# EAGLE design ControlBoard (EAGLE 7.4.0)
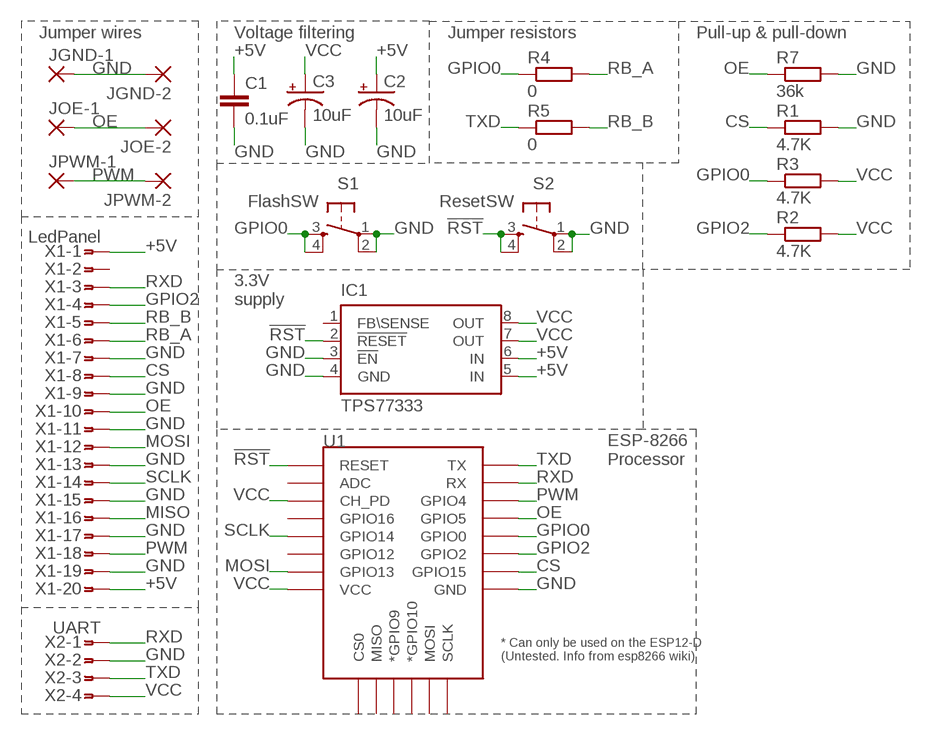
[diagram p0: schematic, sheet 1]

## Parts
C1  0.1uF  0.1UF-25V(+80/-20%)(0603)  [0603-CAP]
C2  10uF  10UF-20V-10%(TANT)  [EIA3528]
C3  10uF  10UF-20V-10%(TANT)  [EIA3528]
IC1  TPS77333  [SOP-08]
JGND-1  SMD2  [SMD1,27-2,54]
JGND-2  SMD2  [SMD1,27-2,54]
JOE-1  SMD2  [SMD1,27-2,54]
JOE-2  SMD2  [SMD1,27-2,54]
JPWM-1  SMD2  [SMD1,27-2,54]
JPWM-2  SMD2  [SMD1,27-2,54]
R1  4.7K  R-EU_R1206  [R1206]
R2  4.7K  R-EU_R1206  [R1206]
R3  4.7K  R-EU_R1206  [R1206]
R4  0  R-EU_R5025W  [R5025W]
R5  0  R-EU_R5025W  [R5025W]
R7  36k  R-EU_M2012  [M2012]
S1  FlashSW  DTSM-6  [DTSM-6]
S2  ResetSW  DTSM-6  [DTSM-6]
U1  ESP12ESMD  [ESP12E-SMD]
X1  LedPanel  SMDTOP-20  [SMDTOP20]
X2  UART  SMDTOP-4  [SMDTOP4]

## Nets
!RST [signal]: IC1.2(!RESET) S2.3 S2.4 U1.RESET
+5V [power]: C1.1 C2.A(+) IC1.5(IN) IC1.6(IN) X1.1 X1.20
CS [signal]: R1.1 U1.GPIO15 X1.8
GND [power]: C1.2 C2.C(-) C3.C(-) IC1.3(!EN) IC1.4(GND) JGND-1.1(P) JGND-2.1(P) R1.2 R7.2 S1.1 S1.2 S2.1 S2.2 U1.GND X1.7 X1.9 X1.11 X1.13 X1.15 X1.17 X1.19 X2.2
GPIO0 [signal]: R3.1 R4.1 S1.3 S1.4 U1.GPIO0
GPIO2 [signal]: R2.1 U1.GPIO2 X1.4
MISO [signal]: X1.16
MOSI [signal]: U1.GPIO13 X1.12
OE [signal]: JOE-1.1(P) JOE-2.1(P) R7.1 U1.GPIO5 X1.10
PWM [signal]: JPWM-1.1(P) JPWM-2.1(P) U1.GPIO4 X1.18
RB_A [signal]: R4.2 X1.6
RB_B [signal]: R5.2 X1.5
RXD [signal]: U1.RXD0(RX) X1.3 X2.1
SCLK [signal]: U1.GPIO14 X1.14
TXD [signal]: R5.1 U1.TXD0(TX) X2.3
VCC [power]: C3.A(+) IC1.7(OUT) IC1.8(OUT) R2.2 R3.2 U1.CH_PD U1.VCC X2.4
Unconnected: IC1.1(FB\SENSE) U1.ADC U1.CS0 U1.GPIO9(*GPIO9) U1.GPIO10(*GPIO10) U1.GPIO12 U1.GPIO16 U1.MISO U1.MOSI U1.SCLK X1.2

## Notes on the sheet
- Jumper wires | Voltage filtering | Jumper resistors | Pull-up & pull-down
- 3.3V
  supply
- ESP-8266
  Processor

## Library data of the parts
C1 = SparkFun-Capacitors:0.1UF-25V(+80/-20%)(0603): CAP-00810 Ceramic Standard decoupling cap; PROD_ID: CAP-00810
C2 C3 = SparkFun-Capacitors:10UF-20V-10%(TANT): CAP-08063; PROD_ID: CAP-08063
IC1 = texas:TPS773*: 250-mA LDO REGULATORS WITH RESET OUTPUT WITH 8-PIN MSOP PACKAGING Source: http://focus.ti.com/lit/ds/symlink/tps77333.pdf; MF: TEXAS INSTRUMENTS; MPN: TPS77333DGK; OC_FARNELL: 1510195; OC_NEWARK: 02M1919
JGND-1 JGND-2 JOE-1 JOE-2 JPWM-1 JPWM-2 = wirepad:SMD2: SMD PAD
R1-R5 R7 = resistor:R-EU_: RESISTOR, European symbol
S1 S2 = switch-tact:DTSM-6
U1 = esp8266modules:ESP12E: ESP12E Module
X1 = con-amp:SMDTOP-20: AMP connector
X2 = con-amp:SMDTOP-4: AMP connector

## Net classes
1 power: width 0.508 mm
2 signal: width 0.508 mm
3 VIN: width 0.61 mm, clearance 2 mm to class 1, clearance 2 mm to class 2

## Board
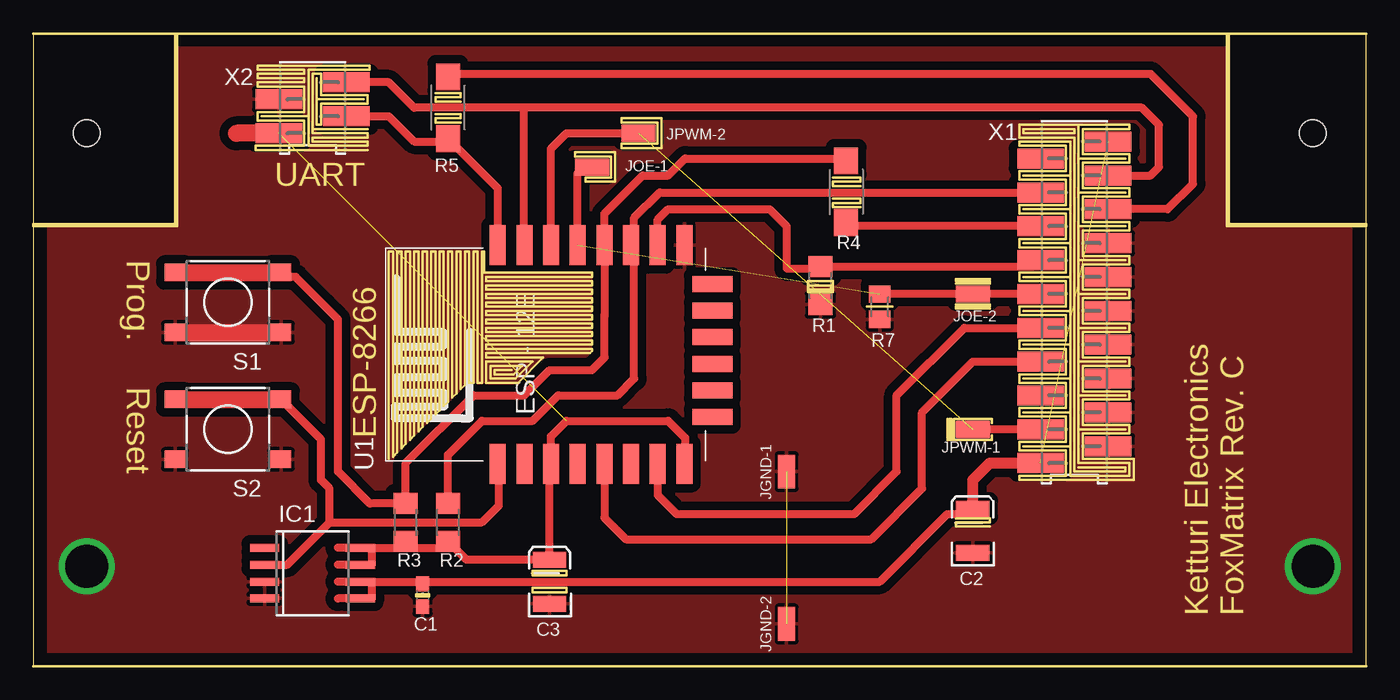
[diagram p1: board, top side]

Size 100 x 47.5 mm. Coordinates in mm from the lower left corner, seen from the top.
Outline: 0,0 100,0 100,47.5 0,47.5 0,0
Copper layers (1*16): Top 0.3mm / dielectric 1.2mm / Bottom 0.035mm
Design rules "CNC 25mil *": minimum track width 20mil, minimum drill 24mil, track to track 25mil, track to pad 25mil, pad to pad 25mil, via to via 25mil, smd to smd 25mil, copper to edge 40mil, drill to drill 16mil, minimum pad ring 10mil, minimum via ring 8mil, stop-mask expansion 4mil, vias tented up to drill 0mil, thermal gap 10mil
Holes 2 mm at 4,40 96,40
Milling: 376 lines

### Footprints (pad centres in the part's own frame; a part is rotated, then mirrored left to right if it is on the bottom)
0603-CAP = smd 1.1 x 1: 1 -0.85,0; 2 0.85,0
EIA3528 = smd 1.2 x 2.5: A 1.65,0; C -1.65,0
SOP-08 = smd 0.6 x 2.2: 1 -1.905,-3.6; 2 -0.635,-3.6; 3 0.635,-3.6; 4 1.905,-3.6; 5 1.905,3.575; 6 0.635,3.575; 7 -0.635,3.575; 8 -1.905,3.575
SMD1,27-2,54 = smd 1.27 x 2.54: 1 0,0
R1206 = smd 1.6 x 1.803: 1 -1.422,0; 2 1.422,0
R5025W = smd 2 x 1.8: 1 -2.311,0; 2 2.311,0
M2012 = smd 1.3 x 1.6: 1 -0.95,0; 2 0.95,0
DTSM-6 = smd 1.55 x 1.3: 1 -3.975,2.25; 2 3.975,2.25; 3 -3.975,-2.25; 4 3.975,-2.25
ESP12E-SMD = smd 3 x 1.2: ADC -8.3,3.8; CH_PD -8.3,1.8; GND 8.1,-8.2; GPIO0 8.1,-2.2; GPIO2 8.1,-4.2; GPIO4 8.1,1.8; GPIO5 8.1,-0.2; GPIO12 -8.3,-4.2; GPIO13 -8.3,-6.2; GPIO14 -8.3,-2.2; GPIO15 8.1,-6.2; GPIO16 -8.3,-0.2; RESET -8.3,5.8; RXD0 8.1,3.8; TXD0 8.1,5.8; VCC -8.3,-8.2 | smd 1.2 x 3: CS0 -4.8,-10.3; GPIO9 -0.8,-10.3; GPIO10 1.2,-10.3; MISO -2.8,-10.3; MOSI 3.2,-10.3; SCLK 5.2,-10.3
SMDTOP20 = smd 1.5 x 3.5: 1 -12.065,2.54; 2 -10.795,-2.54; 3 -9.525,2.54; 4 -8.255,-2.54; 5 -6.985,2.54; 6 -5.715,-2.54; 7 -4.445,2.54; 8 -3.175,-2.54; 9 -1.905,2.54; 10 -0.635,-2.54; 11 0.635,2.54; 12 1.905,-2.54; 13 3.175,2.54; 14 4.445,-2.54; 15 5.715,2.54; 16 6.985,-2.54; 17 8.255,2.54; 18 9.525,-2.54; 19 10.795,2.54; 20 12.065,-2.54
SMDTOP4 = smd 1.5 x 3.5: 1 -1.905,2.54; 2 -0.635,-2.54; 3 0.635,2.54; 4 1.905,-2.54

### Placement (x,y rotation side)
C1  29.21,5.33 270 top
C2  70.48,10.16 90 top
C3  38.73,6.35 90 top
IC1  20.95,6.99 270 top
JGND-1  56.52,14.61 0 top
JGND-2  56.52,3.17 0 top
JOE-1  41.91,37.47 90 top
JOE-2  70.48,27.94 90 top
JPWM-1  70.48,17.78 90 top
JPWM-2  45.4,40.01 90 top
R1  59.05,28.57 270 top
R2  31.11,10.79 270 top
R3  27.94,10.79 270 top
R4  60.99,35.61 270 top
R5  31.11,41.91 90 top
R7  63.5,26.99 270 top
S1  14.61,27.3 180 top
S2  14.61,17.78 180 top
U1  40.64,23.5 90 top
X1  78.11,27.3 270 top
X2  20.95,41.91 270 top

### Tracks (layer width: path | path; a pad name or v marks a point on that pad's centre or on a via)
!RST
  Top 0.61: IC1.2 19.05,7.62 22.23,10.79 | 22.23,10.79 33.66,10.79 34.92,12.06 34.92,15.11 U1.RESET | 22.23,10.79 22.23,13.34 21.59,13.97 21.59,17.02 S2.3
  Top 1.27: S2.4 S2.3
+5V  (1 unrouted)
  Top 0.61: 25.4,6.35 IC1.6 22.86,6.35 | 25.4,6.35 29.21,6.35 | 29.21,6.35 C1.1 | 29.21,6.35 63.5,6.35 68.58,11.43 70.11,11.43 C2.A | 25.4,6.35 25.4,5.08 IC1.5 22.86,5.08
  Top 0.813: C2.A 70.48,13.97 71.75,15.24 X1.20
CS
  Top 0.61: U1.GPIO15 46.84,33.51 47.62,34.29 55.24,34.29 56.52,33.02 56.52,29.84 58.9,29.84 R1.1 75.08,30 X1.8
GND  (via drill 3.2 pad 3.81)  (1 unrouted)
  Top 1.27: S1.2 S1.1
  other vias: 4,7.5 96,7.5
  pour Top: 0,0 100.33,0 100.33,33.02 89.53,33.02 89.53,47.62 10.79,47.62 10.79,33.02 0,33.02
GPIO0
  Top 0.61: R4.1 60.81,38.1 48.9,38.1 47.62,36.83 45.72,36.83 42.84,33.95 U1.GPIO0 42.84,26.33 42.86,26.31 42.86,23.18 41.91,22.23 38.73,22.23 36.83,20.32 33.02,20.32 27.94,15.24 R3.1 25.25,12.22 22.86,14.61 22.86,26.04 19.68,29.21 18.93,29.21 S1.3 | 14.16,29.53 S1.3 | 19.05,29.84 18.87,29.84 S1.3
  Top 1.27: S1.4 S1.3
GPIO2
  Top 0.61: 45.09,31.35 45.09,21.59 43.81,20.32 39.37,20.32 37.47,18.41 33.66,18.41 31.11,15.88 R2.1 | 45.09,31.35 U1.GPIO2 | 45.09,31.35 45.09,33.66 46.99,35.56 X1.4
MOSI
  Top 0.61: U1.GPIO13 46.84,12.85 48.26,11.43 61.59,11.43 64.77,14.61 64.77,20.32 69.85,25.4 X1.12
OE  (1 unrouted)
  Top 0.61: X1.10 JOE-2.1 R7.1 | U1.GPIO5 40.84,37.03 41.27,37.47 JOE-1.1
PWM  (1 unrouted)
  Top 0.61: X1.18 JPWM-1.1 | U1.GPIO4 38.84,38.84 40.01,40.01 JPWM-2.1
RB_A
  Top 0.61: X1.6 61.27,33.02 R4.2
RB_B
  Top 0.61: X1.5 85.09,34.29 87,36.2 87,41.27 83.82,44.45 31.34,44.45 R5.2
RXD
  Top 0.61: U1.RXD0 36.83,31.61 36.83,41.91 | X1.3 83.82,36.83 84.45,37.47 84.45,40.64 83.19,41.91 36.83,41.91 | 36.83,41.91 28.57,41.91 26.67,43.81 X2.1
SCLK
  Top 0.61: U1.GPIO14 42.84,11.13 44.45,9.53 62.87,9.53 66.67,13.34 66.67,19.05 70.48,22.86 X1.14
TXD
  Top 0.61: U1.TXD0 34.84,35.87 R5.1 30.89,39.37 28.57,39.37 26.67,41.27 X2.3
VCC  (1 unrouted)
  Top 0.61: 48.9,15.14 48.9,17.14 47.62,18.41 40.01,18.41 38.84,17.25 U1.CH_PD 38.73,15.09 C3.A 32.49,8 R2.2 30.63,8.89 27.94,8.89 R3.2 27.46,8.89 25.4,8.89 | 48.9,14.61 48.9,15.14 | 48.9,15.14 U1.VCC | 25.4,8.89 IC1.8 22.86,8.89 | 25.4,8.89 25.4,7.62 IC1.7 22.86,7.62
  Top 1.27: X2.4 15.24,40.01

### Text on the board
Milling: UART | Prog. | Reset | ESP-8266 | Ketturi Electronics / FoxMatrix Rev. C